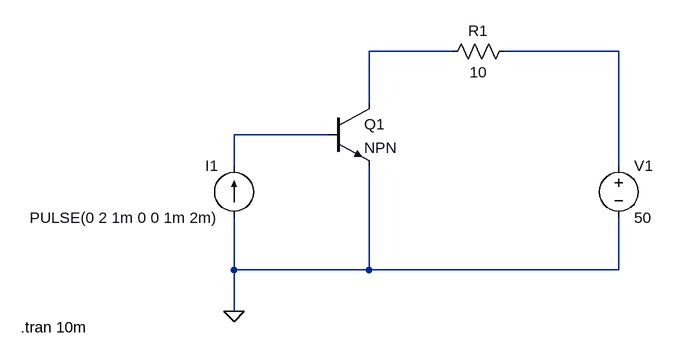
[diagram p0: schematic sw-circuit_2.asc]
sw-circuit_2.asc, the LTspice schematic file:
Version 4.1
SHEET 1 880 680
WIRE -80 80 -208 80
WIRE 176 80 0 80
WIRE -208 160 -208 80
WIRE -272 208 -416 208
WIRE -416 256 -416 208
WIRE 176 256 176 80
WIRE -416 416 -416 336
WIRE -208 416 -208 256
WIRE -208 416 -416 416
WIRE 176 416 176 336
WIRE 176 416 -208 416
WIRE -416 480 -416 416
FLAG -416 480 0
SYMBOL current -416 336 R180
WINDOW 0 24 80 Left 2
WINDOW 3 24 0 Left 2
WINDOW 123 0 0 Left 0
WINDOW 39 0 0 Left 0
SYMATTR InstName I1
SYMATTR Value PULSE(0 2 1m 0 0 1m 2m)
SYMBOL npn2 -272 160 R0
SYMATTR InstName Q1
SYMBOL res -96 96 R270
WINDOW 0 32 56 VTop 2
WINDOW 3 0 56 VBottom 2
SYMATTR InstName R1
SYMATTR Value 10
SYMBOL voltage 176 240 R0
WINDOW 123 0 0 Left 0
WINDOW 39 0 0 Left 0
SYMATTR InstName V1
SYMATTR Value 50
TEXT -744 504 Left 2 !.tran 10m

The netlist it stands for:
* sw-circuit_2.asc
I1 0 N003 PULSE(0 2 1m 0 0 1m 2m)
Q1 N001 N003 0 0 NPN
R1 N001 N002 10
V1 N002 0 50
.model NPN NPN
.model PNP PNP
.lib standard.bjt
.tran 10m
.backanno
.end